# Altium schematic sheet LM2595sx-3.3.SchDoc
size A; SheetNumber: 3; SheetTotal: 6
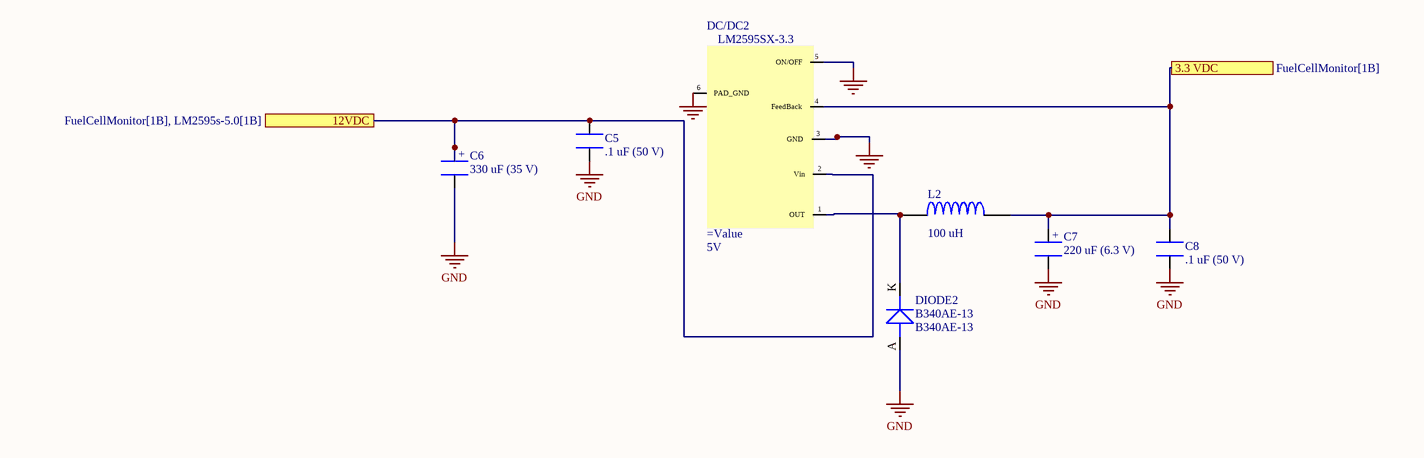
[diagram p0: LM2595sx-3.3.SchDoc]

## Parts
C5  .1 uF (50 V)  [.1uF capacitor]
C6  330 uF (35 V)  [330uf cap]
C7  220 uF (6.3 V)  [220 uf cap]
C8  .1 uF (50 V)  [.1uF capacitor]
DC/DC2  Output Voltage: 5V  [LM2595s-3.3]
DIODE2  B340AE-13  [B340AE-13]
L2  100 uH  [100uH inductor]

## Ports
3.3 VDC (see FuelCellMonitor[1B]), 12VDC (see FuelCellMonitor[1B], LM2595s-5.0[1B])

## Nets
GND: C5.1 C6.2 C7.2 C8.1 DC/DC2.3(GND) DC/DC2.5(ON/OFF) DC/DC2.6(PAD_GND) DIODE2.A
3.3 VDC: C7.1 C8.2 DC/DC2.4(FeedBack) L2.2 ; port 3.3 VDC
12VDC: C5.2 C6.1 DC/DC2.2(Vin) ; port 12VDC
NetDC/DC2_1: DC/DC2.1(OUT) DIODE2.K L2.1

## Notes on the sheet
- (in symbol 220 uF capacitor) +
- (in symbol 330 uF cap) +
- (in symbol LM2595SX-3.3/NOPB_1) LM2595SX-3.3

## Library data of the parts
C5 C8 = .1 uF cap
C6 = 330 uF cap
C7 = 220 uF capacitor
DC/DC2 = LM2595SX-3.3/NOPB_1: SIMPLE SWITCHE Power Converter 150 KHz 1A Step-Down Voltage egulator 5-DDPAK/TO-263; Manufacturer: Texas Instruments; Manufacturer Part Number: LM2595S-5.0/NOPB; Number of Outputs: 1; Efficiency: 82%; Min Input Voltage: 4.5V; Max Input Voltage: 40V; Frequency: 150kHz; Switching Frequency: 173kHz; Quiescent Current: 5mA; Output Type: Fixed; Supplier 1: Digi-Key; RoHS: Yes; Category: Voltage Regulators - Switching; Mount: Surface Mount; Case/Package: TO-263; Number of Pins: 5; Weight: 0.25lb; Min Operating Temperature: -40°C; Max Operating Temperature: 125°C; Output Current: 1A; Package Quantity: 45; Packaging: Rail/Tube; Max Output Current: 1A; Max Supply Voltage: 40V; Min Supply Voltage: 4.5V; Nominal Output Voltage: 5V; Max Output Voltage: 5V; Termination: SMD/SMT; Length: 10.16mm; Width: 8.64mm; Height: 4.57mm; Radiation Hardening: No; Lead Free: Contains Lead; RoHS Compliant: Yes; REACH SVHC: No SVHC; ComponentLink1URL: https://datasheet.ciiva.com/14150/eanatsemico-schaltr-lm2595-en-14150687.pdf?src-supplier=Distrelec; ComponentLink1Description: https://datasheet.ciiva.com/14150/eanatsemico-schaltr-lm2595-en-14150687.pdf?src-supplier=Distrelec; ComponentLink2URL: https://datasheet.ciiva.com/15112/getdatasheetpartid-89913-15112836.pdf?src-supplier=Verical; ComponentLink2Description: https://datasheet.ciiva.com/15112/getdatasheetpartid-89913-15112836.pdf?src-supplier=Verical; ComponentLink3URL: https://datasheet.ciiva.com/25775/1771567-25775403.pdf?src-supplier=Farnell; ComponentLink3Description: https://datasheet.ciiva.com/25775/1771567-25775403.pdf?src-supplier=Farnell; ComponentLink4URL: https://datasheet.ciiva.com/22746/1771567-22746709.pdf?src-supplier=Element14; ComponentLink4Description: https://datasheet.ciiva.com/22746/1771567-22746709.pdf?src-supplier=Element14; ComponentLink5URL: https://datasheet.ciiva.com/3219/lm2595-3219977.pdf?src-supplier=Avnet; ComponentLink5Description: https://datasheet.ciiva.com/3219/lm2595-3219977.pdf?src-supplier=Avnet
DIODE2 = B340AE-13: Schottky Diode, DO-201, 40V, 3.00A; Manufacturer: STMicroelectronics; Max Surge Current: 80A; Average Rectified Current: 3A; Max Reverse Leakage Current: 2mA; Element Configuration: Single; Polarity: Standard; Forward Voltage: 950mV; Capacitance: 190pF; Supplier 1: Mouser; RoHS: Yes; Category: Rectifier Diodes; Stock 1: 125419; Pricing 1: 1=0.47000, 10=0.38600, 50=0.38600, 100=0.26300, 600=0.19700, 1000=0.19700, 1200=0.14700, 2400=0.12700, 9600=0.11900, 10000=0.11900 (USD); Mount: Through Hole; Case/Package: DO-201AD; Number of Pins: 2; Weight: 0.01lb; Min Operating Temperature: -65°C; Max Operating Temperature: 150°C; Package Quantity: 1; Packaging: Tape and Reel; Max Forward Surge Current (Ifsm): 80A; Voltage Rating (DC): 40V; Current Rating: 3A; Output Current: 3A; Max Reverse Voltage (DC): 40V; Series: -; Forward Current: 3A; Max Reverse Current: 2mA; Max Repetitive Reverse Voltage (Vrrm): 40V; Peak Non-Repetitive Surge Current: 80A; Length: 9.5mm; Width: 5.3mm; Height: 5.3mm; Radiation Hardening: No; Lead Free: Lead Free; RoHS Compliant: Yes; REACH SVHC: No SVHC; ComponentLink1URL: https://datasheet.ciiva.com/1177/1689683-1177129.pdf?src-supplier=Element14; ComponentLink1Description: https://datasheet.ciiva.com/1177/1689683-1177129.pdf?src-supplier=Element14; ComponentLink2URL: https://datasheet.ciiva.com/26339/168275-da-01-en-schottky-barrier-rectif-axial-1n5822-26339005.pdf?src-supplier=Conrad; ComponentLink2Description: https://datasheet.ciiva.com/26339/168275-da-01-en-schottky-barrier-rectif-axial-1n5822-26339005.pdf?src-supplier=Conrad; ComponentLink3URL: https://datasheet.ciiva.com/16303/cd00001626-16303311.pdf?src-supplier=Future+Electronics; ComponentLink3Description: https://datasheet.ciiva.com/16303/cd00001626-16303311.pdf?src-supplier=Future+Electronics; ComponentLink4URL: https://datasheet.ciiva.com/916/cd00001626-916051.pdf?src-supplier=Digi-Key; ComponentLink4Description: https://datasheet.ciiva.com/916/cd00001626-916051.pdf?src-supplier=Digi-Key; ComponentLink5URL: https://datasheet.ciiva.com/916/cd00001626-916050.pdf?src-supplier=Digi-Key; ComponentLink5Description: https://datasheet.ciiva.com/916/cd00001626-916050.pdf?src-supplier=Digi-Key; Supplier Part Number 1: 511-1N5822; Manufacturer Part Number: B340AE-13
L2 = 100 uH inductor